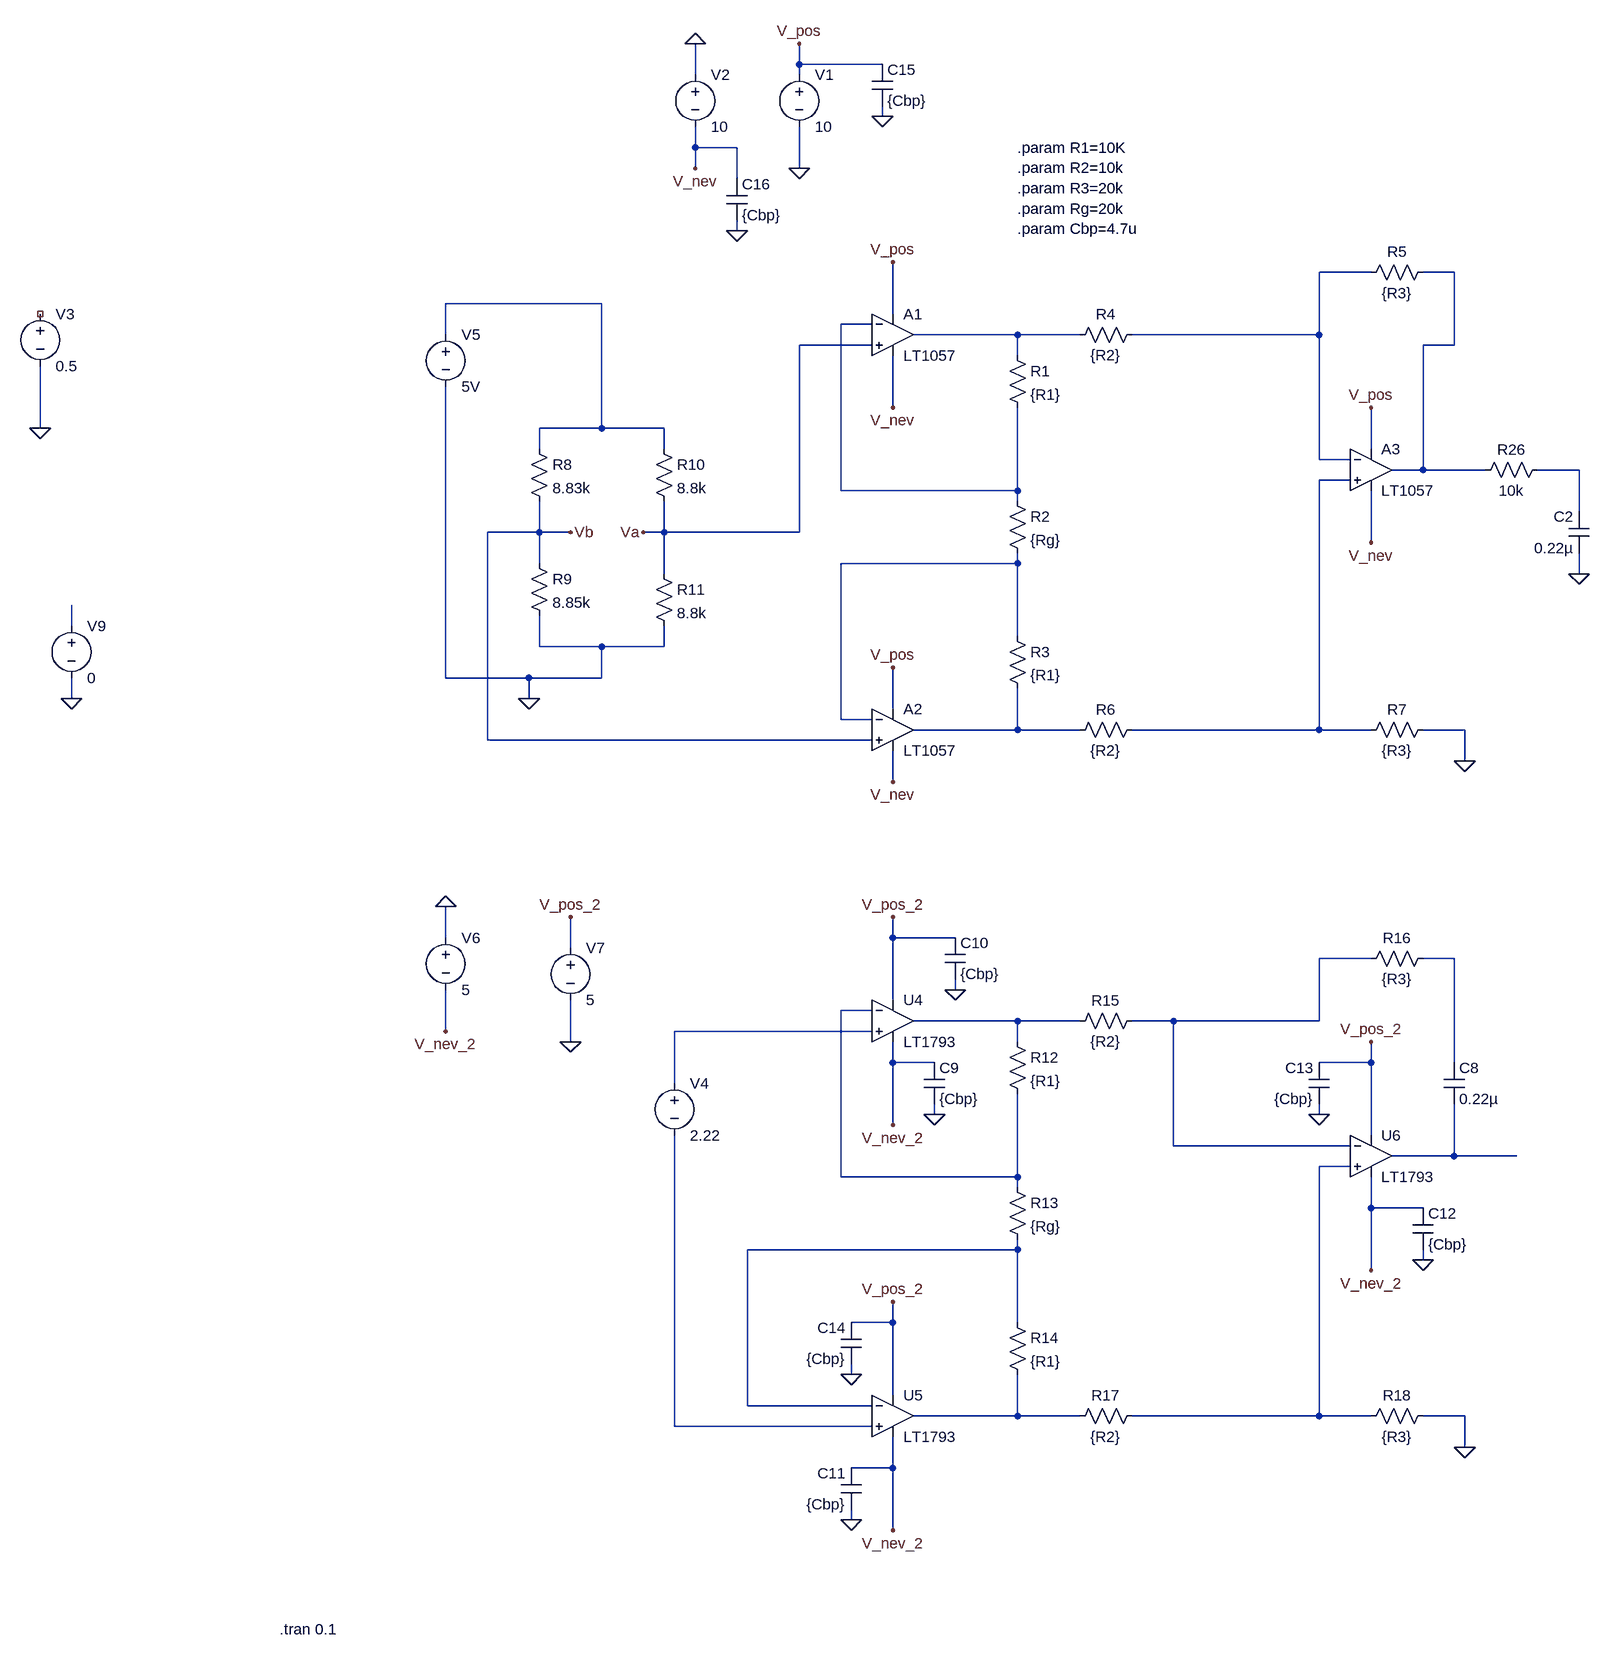
[diagram p0: schematic 6410_instrumentation_amplifier.asc]
6410_instrumentation_amplifier.asc, the LTspice schematic file:
Version 4.1
SHEET 1 1668 2024
WIRE -112 -400 -112 -432
WIRE 16 -400 -112 -400
WIRE -272 -384 -272 -432
WIRE -112 -384 -112 -400
WIRE 16 -320 16 -336
WIRE -272 -272 -272 -304
WIRE -208 -272 -272 -272
WIRE -272 -240 -272 -272
WIRE -112 -240 -112 -304
WIRE -208 -224 -208 -272
WIRE -208 -144 -208 -160
WIRE 768 -80 688 -80
WIRE 896 -80 848 -80
WIRE -416 -32 -656 -32
WIRE 32 -16 32 -96
WIRE 0 0 -48 0
WIRE -656 16 -656 -32
WIRE 224 16 64 16
WIRE 320 16 224 16
WIRE 688 16 688 -80
WIRE 688 16 400 16
WIRE 0 32 -112 32
WIRE 896 32 896 -80
WIRE 896 32 848 32
WIRE 224 48 224 16
WIRE 32 128 32 48
WIRE -1280 160 -1280 64
WIRE -416 160 -416 -32
WIRE -416 160 -512 160
WIRE -320 160 -416 160
WIRE -512 192 -512 160
WIRE -320 192 -320 160
WIRE 768 192 768 128
WIRE 688 208 688 16
WIRE 736 208 688 208
WIRE 848 224 848 32
WIRE 848 224 800 224
WIRE 944 224 848 224
WIRE 1088 224 1024 224
WIRE 736 240 688 240
WIRE -48 256 -48 0
WIRE 224 256 224 128
WIRE 224 256 -48 256
WIRE 224 272 224 256
WIRE 1088 288 1088 224
WIRE -512 320 -512 272
WIRE -512 320 -592 320
WIRE -464 320 -512 320
WIRE -320 320 -320 272
WIRE -320 320 -352 320
WIRE -112 320 -112 32
WIRE -112 320 -320 320
WIRE 768 336 768 256
WIRE -512 368 -512 320
WIRE 224 368 224 352
WIRE 224 368 -48 368
WIRE -320 384 -320 320
WIRE 1088 384 1088 352
WIRE -1232 464 -1232 432
WIRE 224 480 224 368
WIRE -512 496 -512 448
WIRE -416 496 -512 496
WIRE -320 496 -320 464
WIRE -320 496 -416 496
WIRE -656 544 -656 96
WIRE -528 544 -656 544
WIRE -416 544 -416 496
WIRE -416 544 -528 544
WIRE -1232 576 -1232 544
WIRE -528 576 -528 544
WIRE 32 592 32 528
WIRE -48 608 -48 368
WIRE 0 608 -48 608
WIRE 224 624 224 560
WIRE 224 624 64 624
WIRE 320 624 224 624
WIRE 688 624 688 240
WIRE 688 624 400 624
WIRE 768 624 688 624
WIRE 912 624 848 624
WIRE -592 640 -592 320
WIRE 0 640 -592 640
WIRE 912 672 912 624
WIRE 32 704 32 656
WIRE -656 944 -656 896
WIRE 32 944 32 912
WIRE 128 944 32 944
WIRE -464 960 -464 912
WIRE 768 976 688 976
WIRE 896 976 848 976
WIRE 128 1024 128 1008
WIRE 32 1040 32 944
WIRE 0 1056 -48 1056
WIRE 224 1072 64 1072
WIRE 320 1072 224 1072
WIRE 464 1072 400 1072
WIRE 688 1072 688 976
WIRE 688 1072 464 1072
WIRE -656 1088 -656 1024
WIRE 0 1088 -304 1088
WIRE -464 1104 -464 1040
WIRE 224 1104 224 1072
WIRE 32 1136 32 1104
WIRE 96 1136 32 1136
WIRE 768 1136 768 1104
WIRE 768 1136 688 1136
WIRE 896 1136 896 976
WIRE -304 1168 -304 1088
WIRE 96 1216 96 1200
WIRE 688 1216 688 1200
WIRE 32 1232 32 1136
WIRE 768 1248 768 1136
WIRE 464 1264 464 1072
WIRE 736 1264 464 1264
WIRE 896 1280 896 1200
WIRE 896 1280 800 1280
WIRE 992 1280 896 1280
WIRE 736 1296 688 1296
WIRE -48 1312 -48 1056
WIRE 224 1312 224 1184
WIRE 224 1312 -48 1312
WIRE 224 1328 224 1312
WIRE 768 1360 768 1312
WIRE 848 1360 768 1360
WIRE 224 1424 224 1408
WIRE 224 1424 -192 1424
WIRE 848 1440 848 1424
WIRE 768 1456 768 1360
WIRE 32 1536 32 1504
WIRE 32 1536 -32 1536
WIRE 224 1536 224 1424
WIRE -32 1616 -32 1600
WIRE 32 1648 32 1536
WIRE -192 1664 -192 1424
WIRE 0 1664 -192 1664
WIRE 224 1680 224 1616
WIRE 224 1680 64 1680
WIRE 320 1680 224 1680
WIRE 688 1680 688 1296
WIRE 688 1680 400 1680
WIRE 768 1680 688 1680
WIRE 912 1680 848 1680
WIRE -304 1696 -304 1248
WIRE 0 1696 -304 1696
WIRE 912 1728 912 1680
WIRE 32 1760 32 1712
WIRE 32 1760 -32 1760
WIRE -32 1840 -32 1824
WIRE 32 1856 32 1760
FLAG -112 -240 0
FLAG -272 -432 0
FLAG -112 -432 V_pos
FLAG -272 -240 V_nev
FLAG 912 672 0
FLAG -528 576 0
FLAG -464 320 Vb
FLAG -352 320 Va
FLAG 32 128 V_nev
FLAG 32 -96 V_pos
FLAG 32 704 V_nev
FLAG 768 336 V_nev
FLAG 768 128 V_pos
FLAG 32 528 V_pos
FLAG 912 1728 0
FLAG 32 1232 V_nev_2
FLAG 32 912 V_pos_2
FLAG 32 1856 V_nev_2
FLAG 768 1456 V_nev_2
FLAG 768 1104 V_pos_2
FLAG 32 1504 V_pos_2
FLAG 128 1024 0
FLAG 688 1216 0
FLAG 848 1440 0
FLAG -32 1840 0
FLAG -32 1616 0
FLAG 96 1216 0
FLAG -208 -144 0
FLAG 16 -320 0
FLAG -656 896 0
FLAG -656 1088 V_nev_2
FLAG -464 1104 0
FLAG -464 912 V_pos_2
FLAG 1088 384 0
FLAG -1280 160 0
FLAG -1232 576 0
SYMBOL voltage -112 -400 R0
SYMATTR InstName V1
SYMATTR Value 10
SYMBOL voltage -272 -400 R0
WINDOW 123 0 0 Left 0
WINDOW 39 0 0 Left 0
SYMATTR InstName V2
SYMATTR Value 10
SYMBOL res 208 32 R0
SYMATTR InstName R1
SYMATTR Value {R1}
SYMBOL res 208 256 R0
SYMATTR InstName R2
SYMATTR Value {Rg}
SYMBOL res 208 464 R0
SYMATTR InstName R3
SYMATTR Value {R1}
SYMBOL res 416 0 R90
WINDOW 0 0 56 VBottom 2
WINDOW 3 32 56 VTop 2
SYMATTR InstName R4
SYMATTR Value {R2}
SYMBOL res 864 -96 R90
WINDOW 0 0 56 VBottom 2
WINDOW 3 32 56 VTop 2
SYMATTR InstName R5
SYMATTR Value {R3}
SYMBOL res 416 608 R90
WINDOW 0 0 56 VBottom 2
WINDOW 3 32 56 VTop 2
SYMATTR InstName R6
SYMATTR Value {R2}
SYMBOL res 864 608 R90
WINDOW 0 0 56 VBottom 2
WINDOW 3 32 56 VTop 2
SYMATTR InstName R7
SYMATTR Value {R3}
SYMBOL res -528 176 R0
SYMATTR InstName R8
SYMATTR Value 8.83k
SYMBOL res -528 352 R0
SYMATTR InstName R9
SYMATTR Value 8.85k
SYMBOL res -336 176 R0
SYMATTR InstName R10
SYMATTR Value 8.8k
SYMBOL res -336 368 R0
SYMATTR InstName R11
SYMATTR Value 8.8k
SYMBOL voltage -656 0 R0
SYMATTR InstName V5
SYMATTR Value 5V
SYMBOL voltage -1280 -32 R0
WINDOW 123 0 0 Left 0
WINDOW 39 0 0 Left 0
SYMATTR InstName V3
SYMATTR Value 0.5
SYMBOL cap 1104 352 R180
WINDOW 0 24 56 Left 2
WINDOW 3 24 8 Left 2
SYMATTR InstName C2
SYMATTR Value 0.22µ
SYMBOL OpAmps\\LT1793 32 1008 R0
SYMATTR InstName U4
SYMBOL OpAmps\\LT1793 32 1616 R0
SYMATTR InstName U5
SYMBOL OpAmps\\LT1793 768 1216 R0
SYMATTR InstName U6
SYMBOL res 208 1088 R0
SYMATTR InstName R12
SYMATTR Value {R1}
SYMBOL res 208 1312 R0
SYMATTR InstName R13
SYMATTR Value {Rg}
SYMBOL res 208 1520 R0
SYMATTR InstName R14
SYMATTR Value {R1}
SYMBOL res 416 1056 R90
WINDOW 0 0 56 VBottom 2
WINDOW 3 32 56 VTop 2
SYMATTR InstName R15
SYMATTR Value {R2}
SYMBOL res 864 960 R90
WINDOW 0 0 56 VBottom 2
WINDOW 3 32 56 VTop 2
SYMATTR InstName R16
SYMATTR Value {R3}
SYMBOL res 416 1664 R90
WINDOW 0 0 56 VBottom 2
WINDOW 3 32 56 VTop 2
SYMATTR InstName R17
SYMATTR Value {R2}
SYMBOL res 864 1664 R90
WINDOW 0 0 56 VBottom 2
WINDOW 3 32 56 VTop 2
SYMATTR InstName R18
SYMATTR Value {R3}
SYMBOL voltage -304 1152 R0
SYMATTR InstName V4
SYMATTR Value 2.22
SYMBOL cap 880 1136 R0
SYMATTR InstName C8
SYMATTR Value 0.22µ
SYMBOL cap 80 1136 R0
SYMATTR InstName C9
SYMATTR Value {Cbp}
SYMBOL cap 112 944 R0
SYMATTR InstName C10
SYMATTR Value {Cbp}
SYMBOL cap -16 1824 R180
WINDOW 0 24 56 Left 2
WINDOW 3 24 8 Left 2
SYMATTR InstName C11
SYMATTR Value {Cbp}
SYMBOL cap 832 1360 R0
SYMATTR InstName C12
SYMATTR Value {Cbp}
SYMBOL cap 704 1200 R180
WINDOW 0 24 56 Left 2
WINDOW 3 24 8 Left 2
SYMATTR InstName C13
SYMATTR Value {Cbp}
SYMBOL cap -16 1600 R180
WINDOW 0 24 56 Left 2
WINDOW 3 24 8 Left 2
SYMATTR InstName C14
SYMATTR Value {Cbp}
SYMBOL cap 0 -400 R0
SYMATTR InstName C15
SYMATTR Value {Cbp}
SYMBOL cap -224 -224 R0
SYMATTR InstName C16
SYMATTR Value {Cbp}
SYMBOL voltage -656 928 R0
WINDOW 123 0 0 Left 0
WINDOW 39 0 0 Left 0
SYMATTR InstName V6
SYMATTR Value 5
SYMBOL voltage -464 944 R0
SYMATTR InstName V7
SYMATTR Value 5
SYMBOL OpAmps\\LT1057 768 160 R0
SYMATTR InstName A3
SYMBOL OpAmps\\LT1057 32 -48 R0
SYMATTR InstName A1
SYMBOL OpAmps\\LT1057 32 560 R0
SYMATTR InstName A2
SYMBOL res 1040 208 R90
WINDOW 0 0 56 VBottom 2
WINDOW 3 32 56 VTop 2
SYMATTR InstName R26
SYMATTR Value 10k
SYMBOL voltage -1232 448 R0
WINDOW 123 0 0 Left 0
WINDOW 39 0 0 Left 0
SYMATTR InstName V9
SYMATTR Value 0
TEXT 224 -272 Left 2 !.param R1=10K\n.param R2=10k\n.param R3=20k\n.param Rg=20k\n.param Cbp=4.7u
TEXT -912 2008 Left 2 !.tran 0.1

The netlist it stands for:
* 6410_instrumentation_amplifier.asc
V1 V_pos 0 10
V2 0 V_nev 10
R1 N005 N004 {R1}
R2 N004 N008 {Rg}
R3 N008 N010 {R1}
R4 N001 N005 {R2}
R5 N002 N001 {R3}
R6 N007 N010 {R2}
R7 0 N007 {R3}
R8 N003 Vb 8.83k
R9 Vb 0 8.85k
R10 N003 Va 8.8k
R11 Va 0 8.8k
V5 N003 0 5V
V3 NC_01 0 0.5
C2 0 N006 0.22µ
X§U4 N015 N013 V_pos_2 V_nev_2 N014 LT1793  ; pins In+ In- V+ V- OUT
X§U5 N020 N018 V_pos_2 V_nev_2 N019 LT1793  ; pins In+ In- V+ V- OUT
X§U6 N017 N011 V_pos_2 V_nev_2 N016 LT1793  ; pins In+ In- V+ V- OUT
R12 N014 N013 {R1}
R13 N013 N018 {Rg}
R14 N018 N019 {R1}
R15 N011 N014 {R2}
R16 N012 N011 {R3}
R17 N017 N019 {R2}
R18 0 N017 {R3}
V4 N015 N020 2.22
C8 N012 N016 0.22µ
C9 V_nev_2 0 {Cbp}
C10 V_pos_2 0 {Cbp}
C11 0 V_nev_2 {Cbp}
C12 V_nev_2 0 {Cbp}
C13 0 V_pos_2 {Cbp}
C14 0 V_pos_2 {Cbp}
C15 V_pos 0 {Cbp}
C16 V_nev 0 {Cbp}
V6 0 V_nev_2 5
V7 V_pos_2 0 5
X§A3 N007 N001 V_pos V_nev N002 LT1057  ; pins In+ In- V+ V- OUT
X§A1 Va N004 V_pos V_nev N005 LT1057  ; pins In+ In- V+ V- OUT
X§A2 Vb N008 V_pos V_nev N010 LT1057  ; pins In+ In- V+ V- OUT
R26 N006 N002 10k
V9 N009 0 0
.param R1=10K
.param R2=10k
.param R3=20k
.param Rg=20k
.param Cbp=4.7u
.tran 0.1
.lib LTC.lib
.backanno
.end